# Altium schematic sheet usb-serial.SchDoc
size A4
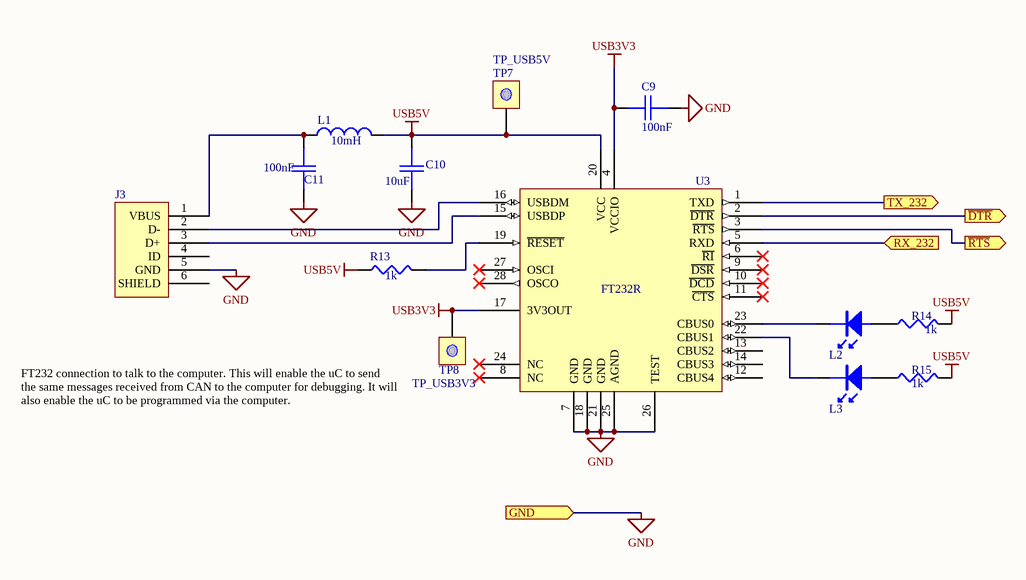
[diagram p0: usb-serial.SchDoc]

## Parts
C9  value 100nF  [0603]  (hidden comment: CAP)
C10  value 10uF  [0603]  (hidden comment: CAP)
C11  value 100nF  [0603]  (hidden comment: CAP)
J3  USB_MINIB  [USBMINIB]  (value not drawn)
L1  value 10mH  [1812]  (hidden comment: INDUCTOR)
L2  LED  [0805LED]  (value not drawn)
L3  LED  [0805LED]  (value not drawn)
R13  value 1k  [0603]  (hidden comment: RES1)
R14  value 1k  [0603]  (hidden comment: RES1)
R15  value 1k  [0603]  (hidden comment: RES1)
TP7  TP_USB5V  [TESTPOINT]
TP8  TP_USB3V3  [TESTPOINT]
U3  FT232R  [SSOP28w]

## Ports
GND (in), RX_232 (in), TX_232 (out), ~{DTR} (out), ~{RTS} (out)

## Nets
GND: C9.2 C10.1 C11.2 J3.5(GND) U3.7(GND) U3.18(GND) U3.21(GND) U3.25(AGND) U3.26(TEST) ; port GND
USB3V3: C9.1 TP8.0(TP) U3.4(VCCIO) U3.17(3V3OUT)
USB5V: C10.2 L1.2 R13.1 R14.2 R15.2 TP7.0(TP) U3.20(VCC)
~{DTR}: U3.2(~{DTR}) ; port ~{DTR}
~{RTS}: U3.3(~{RTS}) ; port ~{RTS}
RX_232: U3.5(RXD) ; port RX_232
TX_232: U3.1(TXD) ; port TX_232
NetC11_1: C11.1 J3.1(VBUS) L1.1
NetJ3_2: J3.2(D-) U3.16(USBDM)
NetJ3_3: J3.3(D+) U3.15(USBDP)
NetL2_A: L2.A R14.1
NetL2_K: L2.K U3.23(CBUS0)
NetL3_A: L3.A R15.1
NetL3_K: L3.K U3.22(CBUS1)
NetR13_2: R13.2 U3.19(~{RESET})

Not connected (* = marked no-connect by the designer): J3 4(ID) 6(SHIELD); U3 6(~{RI})* 8(NC)* 9(~{DSR})* 10(~{DCD})* 11(~{CTS})* 12(CBUS4) 13(CBUS2) 14(CBUS3) 24(NC)* 27(OSCI)* 28(OSCO)*

## Notes on the sheet
- FT232 connection to talk to the computer. This will enable the uC to send the same messages received from CAN to the computer for debugging. It will also enable the uC to be programmed via the computer.

## Library data of the parts
C9-C11 = CAP: Capacitor
J3 = USB_miniB_SMT: USB Mini B Connector; Element14: 9786473; Element14 Price: $3.08
L1 = INDUCTOR: Manufacturer: Generic Components; Class I: Passive; Revision: July-2002: Re-released for DXP Platform.; Published: 8-Jun-2000; Publisher: Altium Limited; Class II: Inductor
R13-R15 = RES1: Resistor
TP7 TP8 = TEST: TEST POINT